# Altium schematic sheet ESP_Link.SchDoc
size A4; SheetNumber: 1; SheetTotal: 1
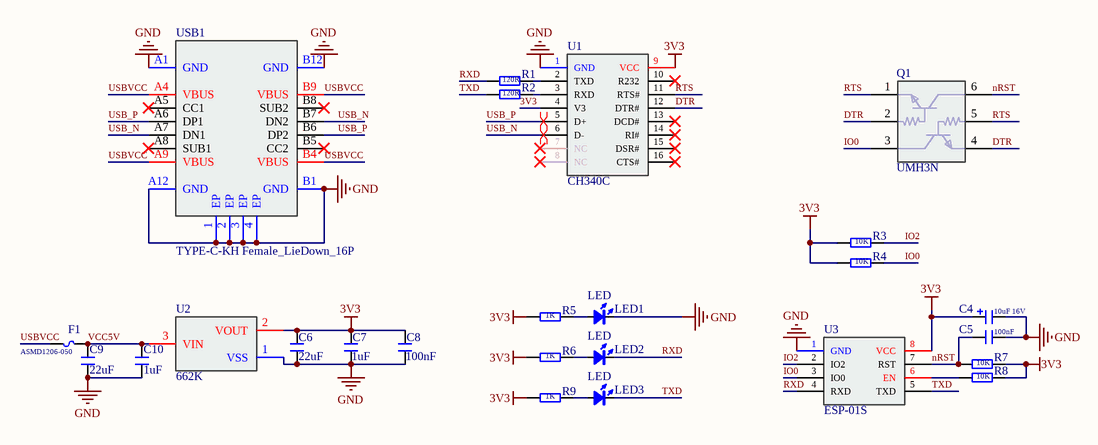
[diagram p0: ESP_Link.SchDoc]

## Parts
C4  10uF 16V  [3216TantalumCap]
C5  100nF  [C0603]
C6  22uF  [C0603]
C7  1uF  [C0603]
C8  100nF  [C0603]
C9  22uF  [C0603]
C10  1uF  [C0603]
F1  ASMD1206-050  [ASMD1206-050]
LED1  LED  [LED_0603]
LED2  LED  [LED_0603]
LED3  LED  [LED_0603]
Q1  UMH3N  [UMH3N]
R1  120R  [R0603]
R2  120R  [R0603]
R3  10K  [R0603]
R4  10K  [R0603]
R5  1K  [R0603]
R6  1K  [R0603]
R7  10K  [R0603]
R8  10K  [R0603]
R9  1K  [R0603]
U1  CH340C  [CH340C]
U2  662K  [662K]
U3  ESP-01S  [ESP-01S-NoSlik]
USB1  TYPE-C-KH Female_LieDown_16P  [TYPE-C-KH Female_LieDown_16P]

## Nets
3V3: C4.1 C6.2 C7.2 C8.2 R3.1 R4.1 R5.1 R6.1 R7.2 R8.2 R9.1 U1.4(V3) U1.9(VCC) U2.2(VOUT) U3.8(VCC)
GND: C4.2 C5.1 C6.1 C7.1 C8.1 C9.1 C10.1 LED1.2(K) U1.1(GND) U2.1(VSS) U3.1(GND) USB1.1(EP) USB1.2(EP) USB1.3(EP) USB1.4(EP) USB1.A1(GND) USB1.A12(GND) USB1.B1(GND) USB1.B12(GND)
DTR: Q1.2(B) Q1.4(E) U1.12(DTR#)
IO0: Q1.3(C) R4.2 U3.3(IO0)
IO2: R3.2 U3.2(IO2)
nRST: C5.2 Q1.6(C) R7.1 U3.7(RST)
RTS: Q1.1(E) Q1.5(B) U1.11(RTS#)
RXD: LED2.2(K) R1.2 U3.4(RXD)
TXD: LED3.2(K) R2.2 U3.5(TXD)
USB_N: U1.6(D-) USB1.A7(DN1) USB1.B7(DN2)
USB_P: U1.5(D+) USB1.A6(DP1) USB1.B6(DP2)
USBVCC: F1.2 USB1.A4(VBUS) USB1.A9(VBUS) USB1.B4(VBUS) USB1.B9(VBUS)
VCC5V: C9.2 C10.2 F1.1 U2.3(VIN)
NetLED1_1: LED1.1(A) R5.2
NetLED2_1: LED2.1(A) R6.2
NetLED3_1: LED3.1(A) R9.2
NetR1_1: R1.1 U1.2(TXD)
NetR2_1: R2.1 U1.3(RXD)
NetR8_1: R8.1 U3.6(EN)

Not connected (* = marked no-connect by the designer): U1 7(NC)* 8(NC)* 10(R232)* 13(DCD#)* 14(RI#)* 15(DSR#)* 16(CTS#)*; USB1 A5(CC1)* A8(SUB1)* B5(CC2)* B8(SUB2)*

## Layout directives
differential pair: USB_N, USB_P

## Library data of the parts
C4 = 3216TantalumCap: 3216钽电容
C5-C10 = C0603: 电容-0603
F1 = ASMD1206-050: 自恢复保险丝
LED1-LED3 = LED_0603
Q1 = UMH3N: 2个NPN预偏压式(双) 100mA 50V
R1-R9 = R0603: 电阻-0603
U2 = 662K: 线性稳压器LDO MaxIN: 6V  OUT: 3.3V
U3 = ESP-01S: ESP01S开发板
USB1 = TYPE-C-KH Female_LieDown_16P: Type-C母座_卧贴_16P